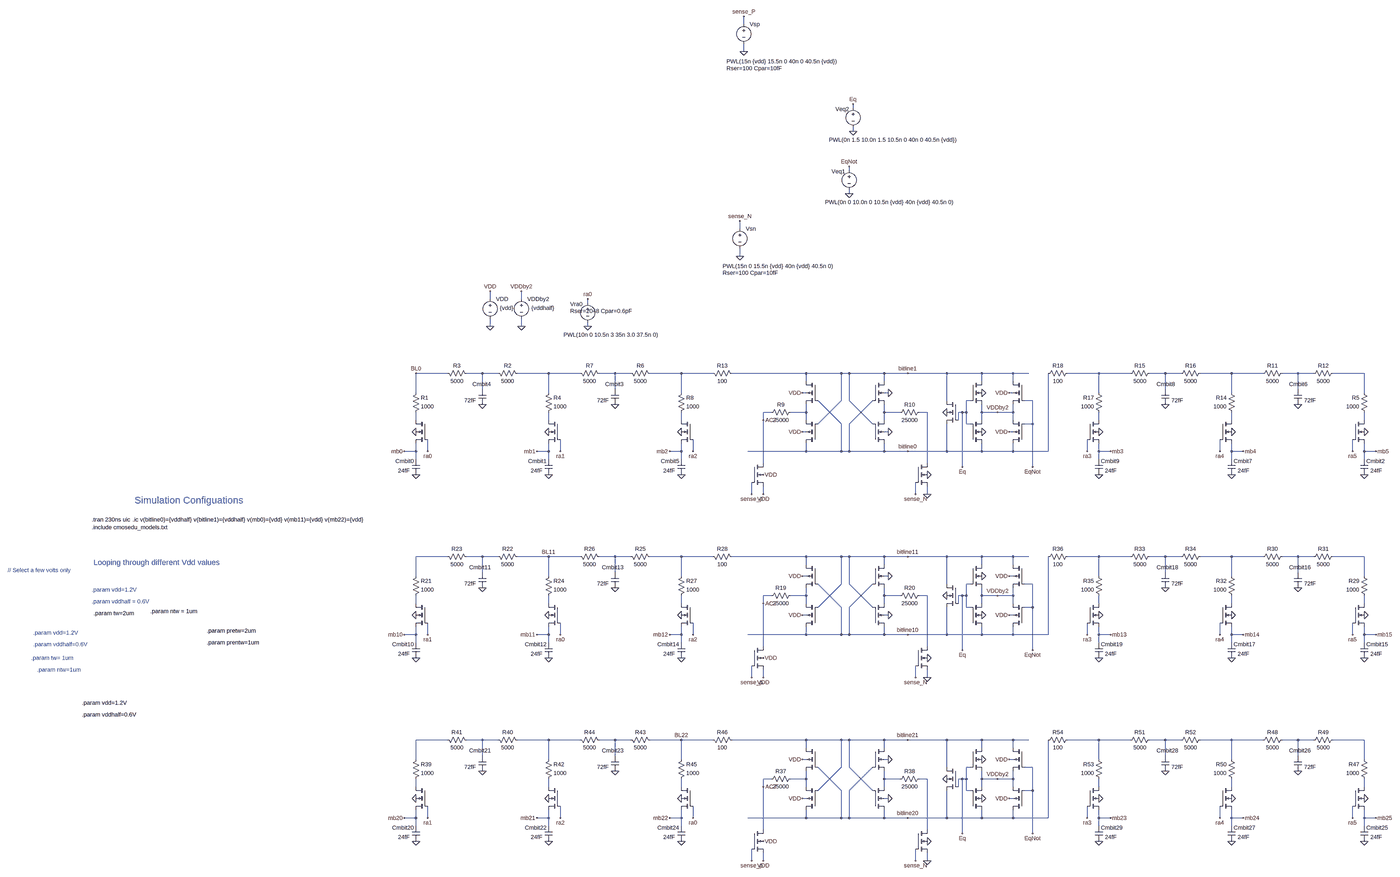
[diagram p0: schematic diva-dram_bitline.asc, whole sheet]
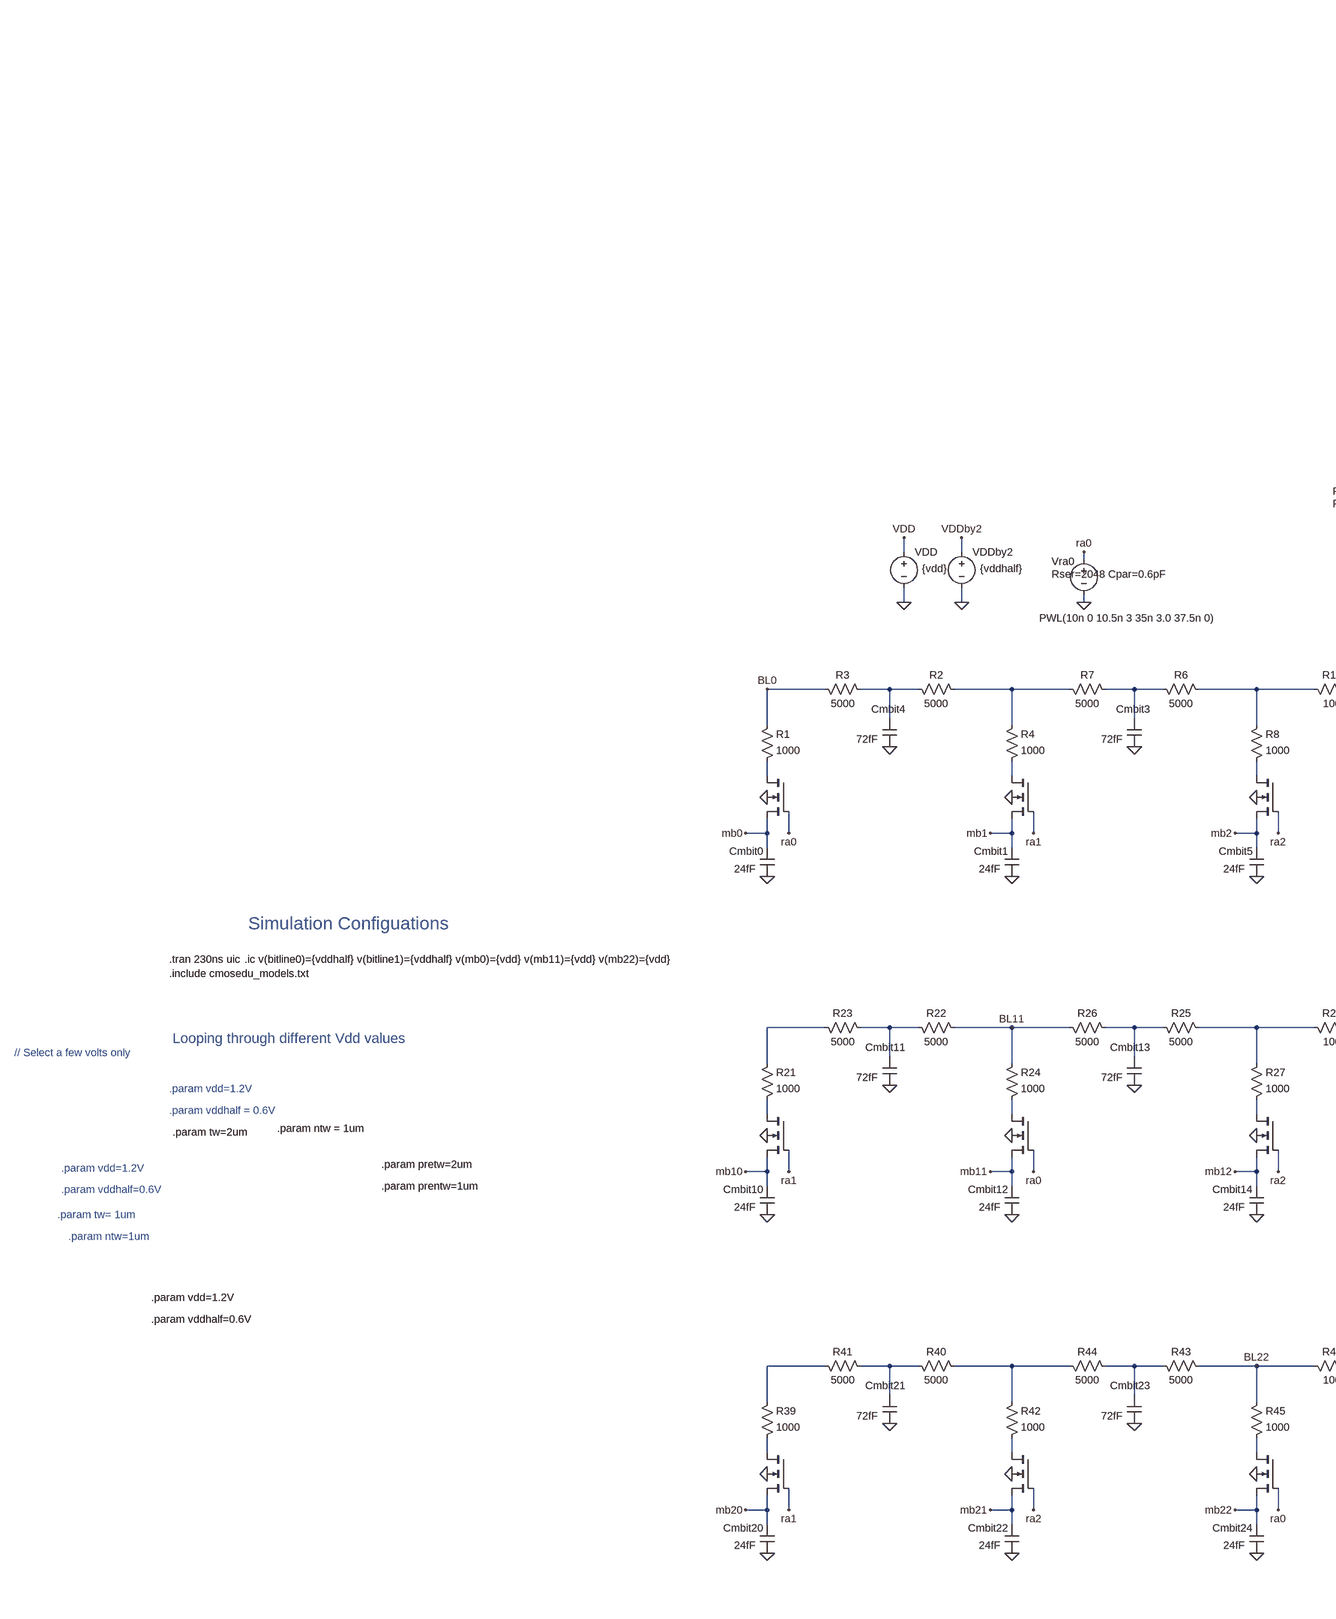
[diagram p1: schematic diva-dram_bitline.asc, part, row 1 of 1, column 1 of 2]
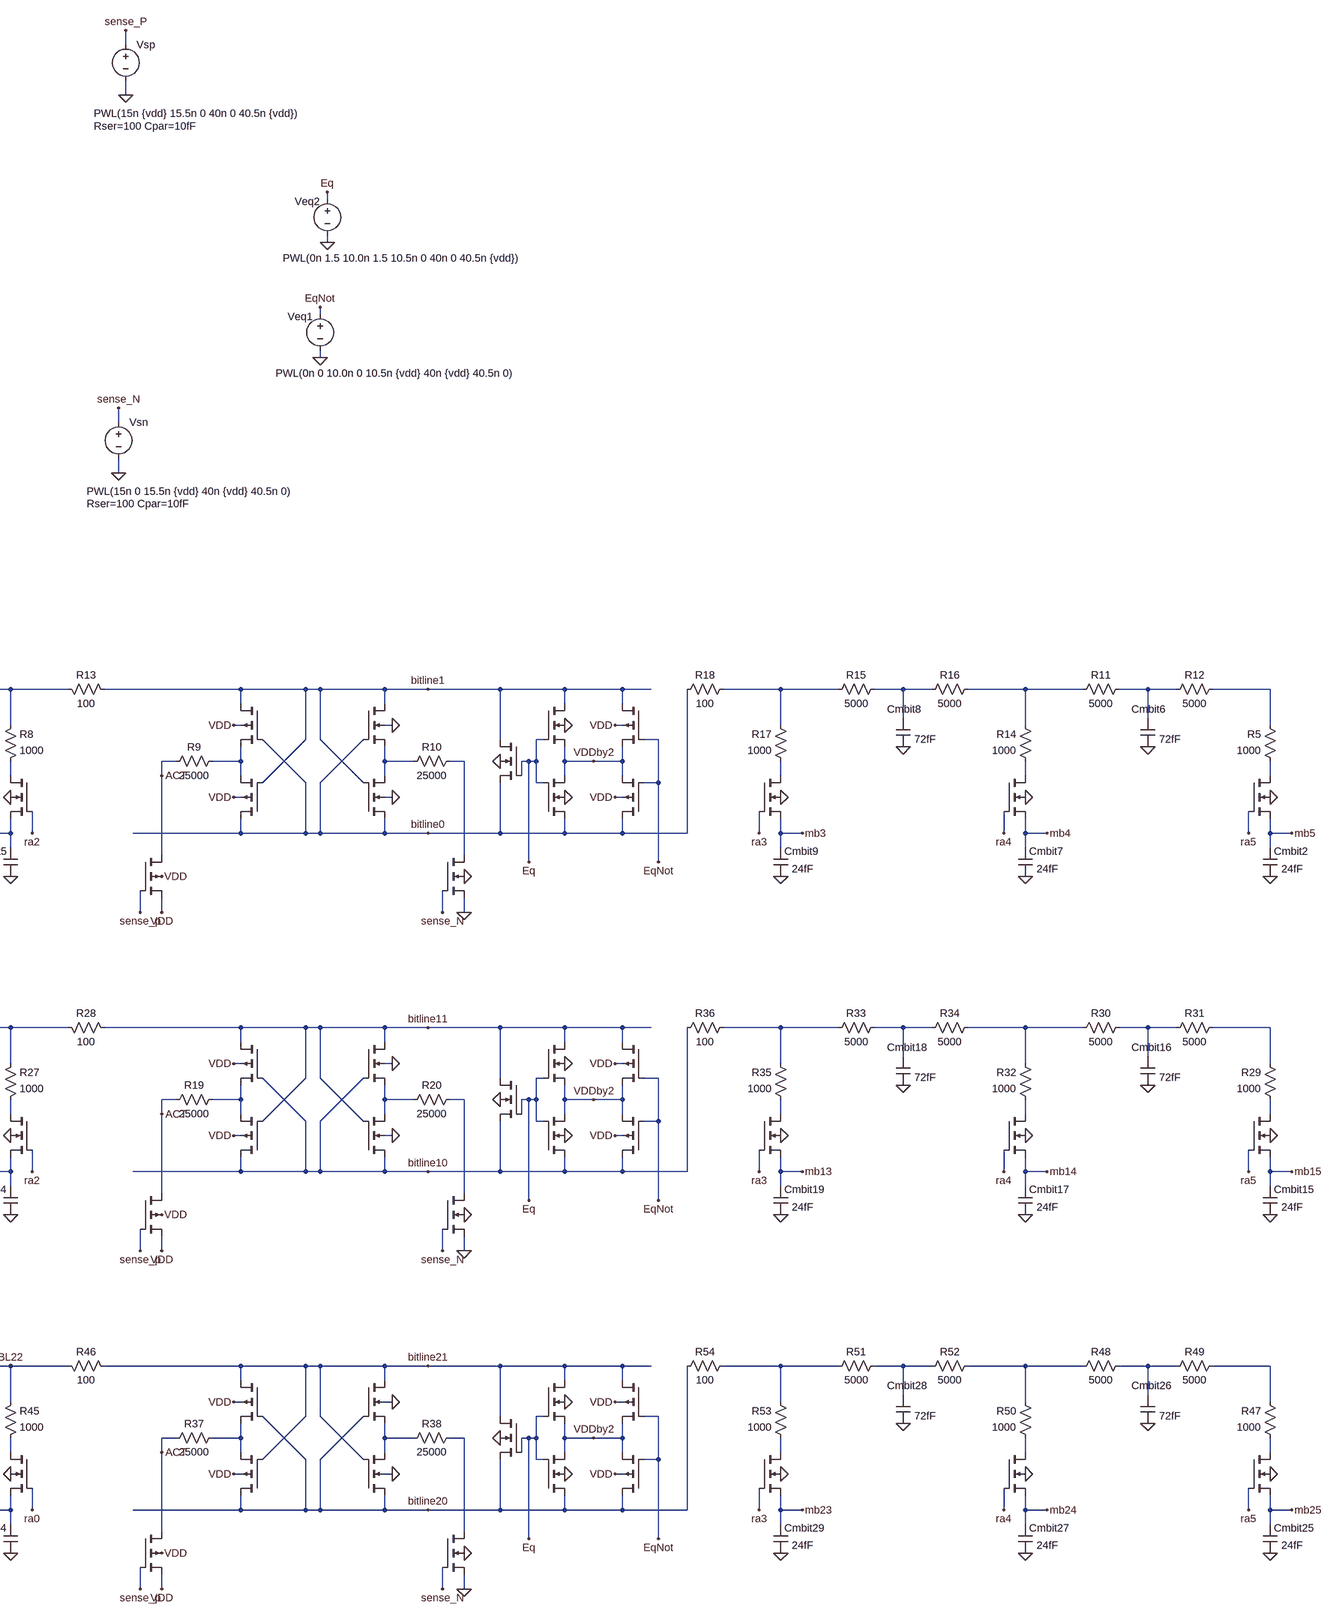
[diagram p2: schematic diva-dram_bitline.asc, part, row 1 of 1, column 2 of 2]
diva-dram_bitline.asc, the LTspice schematic file:
Version 4
SHEET 1 5584 2032
WIRE 2912 -2368 2912 -2400
WIRE 2912 -2256 2912 -2288
WIRE 3360 -2016 3360 -2032
WIRE 3360 -1920 3360 -1936
WIRE 3344 -1760 3344 -1776
WIRE 3344 -1664 3344 -1680
WIRE 2896 -1520 2896 -1552
WIRE 2896 -1408 2896 -1440
WIRE 1872 -1232 1872 -1264
WIRE 2000 -1232 2000 -1264
WIRE 2272 -1216 2272 -1232
WIRE 1872 -1120 1872 -1152
WIRE 2000 -1120 2000 -1152
WIRE 2272 -1120 2272 -1136
WIRE 1696 -112 1568 -112
WIRE 1840 -112 1776 -112
WIRE 1904 -112 1840 -112
WIRE 2112 -112 1984 -112
WIRE 2240 -112 2112 -112
WIRE 2384 -112 2320 -112
WIRE 2448 -112 2384 -112
WIRE 2656 -112 2528 -112
WIRE 2784 -112 2656 -112
WIRE 3168 -112 2864 -112
WIRE 3312 -112 3168 -112
WIRE 3344 -112 3312 -112
WIRE 3488 -112 3344 -112
WIRE 3584 -112 3488 -112
WIRE 3744 -112 3584 -112
WIRE 3888 -112 3744 -112
WIRE 4016 -112 3888 -112
WIRE 4080 -112 4016 -112
WIRE 4368 -112 4240 -112
WIRE 4496 -112 4368 -112
WIRE 4640 -112 4576 -112
WIRE 4704 -112 4640 -112
WIRE 4912 -112 4784 -112
WIRE 5040 -112 4912 -112
WIRE 5184 -112 5120 -112
WIRE 5248 -112 5184 -112
WIRE 5456 -112 5328 -112
WIRE 3168 -80 3168 -112
WIRE 3488 -80 3488 -112
WIRE 3888 -80 3888 -112
WIRE 4016 -80 4016 -112
WIRE 1840 -48 1840 -112
WIRE 2384 -48 2384 -112
WIRE 4640 -48 4640 -112
WIRE 5184 -48 5184 -112
WIRE 1568 -32 1568 -112
WIRE 2112 -32 2112 -112
WIRE 2656 -32 2656 -112
WIRE 3168 -32 3152 -32
WIRE 3504 -32 3488 -32
WIRE 4016 -32 4000 -32
WIRE 4368 -32 4368 -112
WIRE 4912 -32 4912 -112
WIRE 5456 -32 5456 -112
WIRE 3312 0 3312 -112
WIRE 3344 0 3344 -112
WIRE 3744 0 3744 -112
WIRE 3840 0 3824 0
WIRE 4096 0 4064 0
WIRE 3024 48 2992 48
WIRE 3168 48 3168 16
WIRE 3168 48 3104 48
WIRE 3488 48 3488 16
WIRE 3552 48 3488 48
WIRE 3664 48 3632 48
WIRE 3808 48 3792 48
WIRE 3824 48 3824 0
WIRE 3824 48 3808 48
WIRE 3888 48 3888 16
WIRE 3952 48 3888 48
WIRE 4016 48 4016 16
WIRE 4016 48 3952 48
WIRE 1568 80 1568 48
WIRE 2112 80 2112 48
WIRE 2656 80 2656 48
WIRE 2992 80 2992 48
WIRE 3168 80 3168 48
WIRE 3488 80 3488 48
WIRE 3792 80 3792 48
WIRE 3888 80 3888 48
WIRE 4016 80 4016 48
WIRE 4368 80 4368 48
WIRE 4912 80 4912 48
WIRE 5456 80 5456 48
WIRE 3216 96 3312 0
WIRE 3312 96 3216 0
WIRE 3344 96 3440 0
WIRE 3440 96 3344 0
WIRE 3824 96 3824 48
WIRE 3840 96 3824 96
WIRE 4096 96 4096 0
WIRE 4096 96 4064 96
WIRE 3168 128 3152 128
WIRE 3504 128 3488 128
WIRE 4016 128 4000 128
WIRE 1568 208 1568 176
WIRE 1568 208 1520 208
WIRE 1616 208 1616 160
WIRE 2112 208 2112 176
WIRE 2112 208 2064 208
WIRE 2160 208 2160 160
WIRE 2656 208 2656 176
WIRE 2656 208 2608 208
WIRE 2704 208 2704 160
WIRE 3168 208 3168 176
WIRE 3168 208 2928 208
WIRE 3312 208 3312 96
WIRE 3312 208 3168 208
WIRE 3344 208 3344 96
WIRE 3344 208 3312 208
WIRE 3488 208 3488 176
WIRE 3488 208 3344 208
WIRE 3584 208 3488 208
WIRE 3744 208 3744 96
WIRE 3744 208 3584 208
WIRE 3888 208 3888 176
WIRE 3888 208 3744 208
WIRE 4016 208 4016 176
WIRE 4016 208 3888 208
WIRE 4160 208 4160 -112
WIRE 4160 208 4016 208
WIRE 4320 208 4320 160
WIRE 4368 208 4368 176
WIRE 4416 208 4368 208
WIRE 4864 208 4864 160
WIRE 4912 208 4912 176
WIRE 4960 208 4912 208
WIRE 5408 208 5408 160
WIRE 5456 208 5456 176
WIRE 5504 208 5456 208
WIRE 1568 240 1568 208
WIRE 2112 240 2112 208
WIRE 2656 240 2656 208
WIRE 4368 240 4368 208
WIRE 4912 240 4912 208
WIRE 5456 240 5456 208
WIRE 2992 256 2992 80
WIRE 3664 256 3664 48
WIRE 3808 272 3808 48
WIRE 4096 272 4096 96
WIRE 2944 384 2944 336
WIRE 2992 384 2992 352
WIRE 3616 384 3616 336
WIRE 3664 384 3664 352
WIRE 1696 640 1568 640
WIRE 1840 640 1776 640
WIRE 1904 640 1840 640
WIRE 2112 640 1984 640
WIRE 2240 640 2112 640
WIRE 2384 640 2320 640
WIRE 2448 640 2384 640
WIRE 2656 640 2528 640
WIRE 2784 640 2656 640
WIRE 3168 640 2864 640
WIRE 3312 640 3168 640
WIRE 3344 640 3312 640
WIRE 3488 640 3344 640
WIRE 3584 640 3488 640
WIRE 3744 640 3584 640
WIRE 3888 640 3744 640
WIRE 4016 640 3888 640
WIRE 4080 640 4016 640
WIRE 4368 640 4240 640
WIRE 4496 640 4368 640
WIRE 4640 640 4576 640
WIRE 4704 640 4640 640
WIRE 4912 640 4784 640
WIRE 5040 640 4912 640
WIRE 5184 640 5120 640
WIRE 5248 640 5184 640
WIRE 5456 640 5328 640
WIRE 3168 672 3168 640
WIRE 3488 672 3488 640
WIRE 3888 672 3888 640
WIRE 4016 672 4016 640
WIRE 1840 704 1840 640
WIRE 2384 704 2384 640
WIRE 4640 704 4640 640
WIRE 5184 704 5184 640
WIRE 1568 720 1568 640
WIRE 2112 720 2112 640
WIRE 2656 720 2656 640
WIRE 3168 720 3152 720
WIRE 3504 720 3488 720
WIRE 4016 720 4000 720
WIRE 4368 720 4368 640
WIRE 4912 720 4912 640
WIRE 5456 720 5456 640
WIRE 3312 752 3312 640
WIRE 3344 752 3344 640
WIRE 3744 752 3744 640
WIRE 3840 752 3824 752
WIRE 4096 752 4064 752
WIRE 3024 800 2992 800
WIRE 3168 800 3168 768
WIRE 3168 800 3104 800
WIRE 3488 800 3488 768
WIRE 3552 800 3488 800
WIRE 3664 800 3632 800
WIRE 3808 800 3792 800
WIRE 3824 800 3824 752
WIRE 3824 800 3808 800
WIRE 3888 800 3888 768
WIRE 3952 800 3888 800
WIRE 4016 800 4016 768
WIRE 4016 800 3952 800
WIRE 1568 832 1568 800
WIRE 2112 832 2112 800
WIRE 2656 832 2656 800
WIRE 2992 832 2992 800
WIRE 3168 832 3168 800
WIRE 3488 832 3488 800
WIRE 3792 832 3792 800
WIRE 3888 832 3888 800
WIRE 4016 832 4016 800
WIRE 4368 832 4368 800
WIRE 4912 832 4912 800
WIRE 5456 832 5456 800
WIRE 3216 848 3312 752
WIRE 3312 848 3216 752
WIRE 3344 848 3440 752
WIRE 3440 848 3344 752
WIRE 3824 848 3824 800
WIRE 3840 848 3824 848
WIRE 4096 848 4096 752
WIRE 4096 848 4064 848
WIRE 3168 880 3152 880
WIRE 3504 880 3488 880
WIRE 4016 880 4000 880
WIRE 1568 960 1568 928
WIRE 1568 960 1520 960
WIRE 1616 960 1616 912
WIRE 2112 960 2112 928
WIRE 2112 960 2064 960
WIRE 2160 960 2160 912
WIRE 2656 960 2656 928
WIRE 2656 960 2608 960
WIRE 2704 960 2704 912
WIRE 3168 960 3168 928
WIRE 3168 960 2928 960
WIRE 3312 960 3312 848
WIRE 3312 960 3168 960
WIRE 3344 960 3344 848
WIRE 3344 960 3312 960
WIRE 3488 960 3488 928
WIRE 3488 960 3344 960
WIRE 3584 960 3488 960
WIRE 3744 960 3744 848
WIRE 3744 960 3584 960
WIRE 3888 960 3888 928
WIRE 3888 960 3744 960
WIRE 4016 960 4016 928
WIRE 4016 960 3888 960
WIRE 4160 960 4160 640
WIRE 4160 960 4016 960
WIRE 4320 960 4320 912
WIRE 4368 960 4368 928
WIRE 4416 960 4368 960
WIRE 4864 960 4864 912
WIRE 4912 960 4912 928
WIRE 4960 960 4912 960
WIRE 5408 960 5408 912
WIRE 5456 960 5456 928
WIRE 5504 960 5456 960
WIRE 1568 992 1568 960
WIRE 2112 992 2112 960
WIRE 2656 992 2656 960
WIRE 4368 992 4368 960
WIRE 4912 992 4912 960
WIRE 5456 992 5456 960
WIRE 2992 1008 2992 832
WIRE 3664 1008 3664 800
WIRE 3808 1024 3808 800
WIRE 4096 1024 4096 848
WIRE 2944 1136 2944 1088
WIRE 2992 1136 2992 1104
WIRE 3616 1136 3616 1088
WIRE 3664 1136 3664 1104
WIRE 1696 1392 1568 1392
WIRE 1840 1392 1776 1392
WIRE 1904 1392 1840 1392
WIRE 2112 1392 1984 1392
WIRE 2240 1392 2112 1392
WIRE 2384 1392 2320 1392
WIRE 2448 1392 2384 1392
WIRE 2656 1392 2528 1392
WIRE 2784 1392 2656 1392
WIRE 3168 1392 2864 1392
WIRE 3312 1392 3168 1392
WIRE 3344 1392 3312 1392
WIRE 3488 1392 3344 1392
WIRE 3584 1392 3488 1392
WIRE 3744 1392 3584 1392
WIRE 3888 1392 3744 1392
WIRE 4016 1392 3888 1392
WIRE 4080 1392 4016 1392
WIRE 4368 1392 4240 1392
WIRE 4496 1392 4368 1392
WIRE 4640 1392 4576 1392
WIRE 4704 1392 4640 1392
WIRE 4912 1392 4784 1392
WIRE 5040 1392 4912 1392
WIRE 5184 1392 5120 1392
WIRE 5248 1392 5184 1392
WIRE 5456 1392 5328 1392
WIRE 3168 1424 3168 1392
WIRE 3488 1424 3488 1392
WIRE 3888 1424 3888 1392
WIRE 4016 1424 4016 1392
WIRE 1840 1456 1840 1392
WIRE 2384 1456 2384 1392
WIRE 4640 1456 4640 1392
WIRE 5184 1456 5184 1392
WIRE 1568 1472 1568 1392
WIRE 2112 1472 2112 1392
WIRE 2656 1472 2656 1392
WIRE 3168 1472 3152 1472
WIRE 3504 1472 3488 1472
WIRE 4016 1472 4000 1472
WIRE 4368 1472 4368 1392
WIRE 4912 1472 4912 1392
WIRE 5456 1472 5456 1392
WIRE 3312 1504 3312 1392
WIRE 3344 1504 3344 1392
WIRE 3744 1504 3744 1392
WIRE 3840 1504 3824 1504
WIRE 4096 1504 4064 1504
WIRE 3024 1552 2992 1552
WIRE 3168 1552 3168 1520
WIRE 3168 1552 3104 1552
WIRE 3488 1552 3488 1520
WIRE 3552 1552 3488 1552
WIRE 3664 1552 3632 1552
WIRE 3808 1552 3792 1552
WIRE 3824 1552 3824 1504
WIRE 3824 1552 3808 1552
WIRE 3888 1552 3888 1520
WIRE 3952 1552 3888 1552
WIRE 4016 1552 4016 1520
WIRE 4016 1552 3952 1552
WIRE 1568 1584 1568 1552
WIRE 2112 1584 2112 1552
WIRE 2656 1584 2656 1552
WIRE 2992 1584 2992 1552
WIRE 3168 1584 3168 1552
WIRE 3488 1584 3488 1552
WIRE 3792 1584 3792 1552
WIRE 3888 1584 3888 1552
WIRE 4016 1584 4016 1552
WIRE 4368 1584 4368 1552
WIRE 4912 1584 4912 1552
WIRE 5456 1584 5456 1552
WIRE 3216 1600 3312 1504
WIRE 3312 1600 3216 1504
WIRE 3344 1600 3440 1504
WIRE 3440 1600 3344 1504
WIRE 3824 1600 3824 1552
WIRE 3840 1600 3824 1600
WIRE 4096 1600 4096 1504
WIRE 4096 1600 4064 1600
WIRE 3168 1632 3152 1632
WIRE 3504 1632 3488 1632
WIRE 4016 1632 4000 1632
WIRE 1568 1712 1568 1680
WIRE 1568 1712 1520 1712
WIRE 1616 1712 1616 1664
WIRE 2112 1712 2112 1680
WIRE 2112 1712 2064 1712
WIRE 2160 1712 2160 1664
WIRE 2656 1712 2656 1680
WIRE 2656 1712 2608 1712
WIRE 2704 1712 2704 1664
WIRE 3168 1712 3168 1680
WIRE 3168 1712 2928 1712
WIRE 3312 1712 3312 1600
WIRE 3312 1712 3168 1712
WIRE 3344 1712 3344 1600
WIRE 3344 1712 3312 1712
WIRE 3488 1712 3488 1680
WIRE 3488 1712 3344 1712
WIRE 3584 1712 3488 1712
WIRE 3744 1712 3744 1600
WIRE 3744 1712 3584 1712
WIRE 3888 1712 3888 1680
WIRE 3888 1712 3744 1712
WIRE 4016 1712 4016 1680
WIRE 4016 1712 3888 1712
WIRE 4160 1712 4160 1392
WIRE 4160 1712 4016 1712
WIRE 4320 1712 4320 1664
WIRE 4368 1712 4368 1680
WIRE 4416 1712 4368 1712
WIRE 4864 1712 4864 1664
WIRE 4912 1712 4912 1680
WIRE 4960 1712 4912 1712
WIRE 5408 1712 5408 1664
WIRE 5456 1712 5456 1680
WIRE 5504 1712 5456 1712
WIRE 1568 1744 1568 1712
WIRE 2112 1744 2112 1712
WIRE 2656 1744 2656 1712
WIRE 4368 1744 4368 1712
WIRE 4912 1744 4912 1712
WIRE 5456 1744 5456 1712
WIRE 2992 1760 2992 1584
WIRE 3664 1760 3664 1552
WIRE 3808 1776 3808 1552
WIRE 4096 1776 4096 1600
WIRE 2944 1888 2944 1840
WIRE 2992 1888 2992 1856
WIRE 3616 1888 3616 1840
WIRE 3664 1888 3664 1856
FLAG 1872 -1120 0
FLAG 1872 -1264 VDD
FLAG 2000 -1120 0
FLAG 2000 -1264 VDDby2
FLAG 2912 -2256 0
FLAG 2912 -2400 sense_P
FLAG 2272 -1120 0
FLAG 2272 -1232 ra0
FLAG 2896 -1408 0
FLAG 2896 -1552 sense_N
FLAG 3344 -1664 0
FLAG 3344 -1776 EqNot
FLAG 3360 -1920 0
FLAG 3360 -2032 Eq
FLAG 3152 -32 VDD
FLAG 2992 80 ACT
FLAG 3152 128 VDD
FLAG 3504 128 0
FLAG 3504 -32 0
FLAG 3744 48 0
FLAG 3888 128 0
FLAG 3888 -32 0
FLAG 3808 272 Eq
FLAG 3952 48 VDDby2
FLAG 3584 208 bitline0
FLAG 3584 -112 bitline1
FLAG 4096 272 EqNot
FLAG 4000 128 VDD
FLAG 4000 -32 VDD
FLAG 3664 304 0
FLAG 3616 384 sense_N
FLAG 3664 384 0
FLAG 2992 304 VDD
FLAG 2992 384 VDD
FLAG 2944 384 sense_p
FLAG 1568 128 0
FLAG 1568 304 0
FLAG 1520 208 mb0
FLAG 1616 208 ra0
FLAG 1840 16 0
FLAG 2112 128 0
FLAG 2112 304 0
FLAG 2064 208 mb1
FLAG 2160 208 ra1
FLAG 2384 16 0
FLAG 2656 128 0
FLAG 2656 304 0
FLAG 2608 208 mb2
FLAG 2704 208 ra2
FLAG 5456 128 0
FLAG 5456 304 0
FLAG 5504 208 mb5
FLAG 5408 208 ra5
FLAG 5184 16 0
FLAG 4912 128 0
FLAG 4912 304 0
FLAG 4960 208 mb4
FLAG 4864 208 ra4
FLAG 4640 16 0
FLAG 4368 128 0
FLAG 4368 304 0
FLAG 4416 208 mb3
FLAG 4320 208 ra3
FLAG 3152 720 VDD
FLAG 2992 832 ACT
FLAG 3152 880 VDD
FLAG 3504 880 0
FLAG 3504 720 0
FLAG 3744 800 0
FLAG 3888 880 0
FLAG 3888 720 0
FLAG 3808 1024 Eq
FLAG 3952 800 VDDby2
FLAG 3584 960 bitline10
FLAG 3584 640 bitline11
FLAG 4096 1024 EqNot
FLAG 4000 880 VDD
FLAG 4000 720 VDD
FLAG 3664 1056 0
FLAG 3616 1136 sense_N
FLAG 3664 1136 0
FLAG 2992 1056 VDD
FLAG 2992 1136 VDD
FLAG 2944 1136 sense_p
FLAG 1568 880 0
FLAG 1568 1056 0
FLAG 1520 960 mb10
FLAG 1616 960 ra1
FLAG 1840 768 0
FLAG 2112 880 0
FLAG 2112 1056 0
FLAG 2064 960 mb11
FLAG 2160 960 ra0
FLAG 2384 768 0
FLAG 2656 880 0
FLAG 2656 1056 0
FLAG 2608 960 mb12
FLAG 2704 960 ra2
FLAG 5456 880 0
FLAG 5456 1056 0
FLAG 5504 960 mb15
FLAG 5408 960 ra5
FLAG 5184 768 0
FLAG 4912 880 0
FLAG 4912 1056 0
FLAG 4960 960 mb14
FLAG 4864 960 ra4
FLAG 4640 768 0
FLAG 4368 880 0
FLAG 4368 1056 0
FLAG 4416 960 mb13
FLAG 4320 960 ra3
FLAG 1568 -112 BL0
FLAG 2112 640 BL11
FLAG 3152 1472 VDD
FLAG 2992 1584 ACT
FLAG 3152 1632 VDD
FLAG 3504 1632 0
FLAG 3504 1472 0
FLAG 3744 1552 0
FLAG 3888 1632 0
FLAG 3888 1472 0
FLAG 3808 1776 Eq
FLAG 3952 1552 VDDby2
FLAG 3584 1712 bitline20
FLAG 3584 1392 bitline21
FLAG 4096 1776 EqNot
FLAG 4000 1632 VDD
FLAG 4000 1472 VDD
FLAG 3664 1808 0
FLAG 3616 1888 sense_N
FLAG 3664 1888 0
FLAG 2992 1808 VDD
FLAG 2992 1888 VDD
FLAG 2944 1888 sense_p
FLAG 1568 1632 0
FLAG 1568 1808 0
FLAG 1520 1712 mb20
FLAG 1616 1712 ra1
FLAG 1840 1520 0
FLAG 2112 1632 0
FLAG 2112 1808 0
FLAG 2064 1712 mb21
FLAG 2160 1712 ra2
FLAG 2384 1520 0
FLAG 2656 1632 0
FLAG 2656 1808 0
FLAG 2608 1712 mb22
FLAG 2704 1712 ra0
FLAG 5456 1632 0
FLAG 5456 1808 0
FLAG 5504 1712 mb25
FLAG 5408 1712 ra5
FLAG 5184 1520 0
FLAG 4912 1632 0
FLAG 4912 1808 0
FLAG 4960 1712 mb24
FLAG 4864 1712 ra4
FLAG 4640 1520 0
FLAG 4368 1632 0
FLAG 4368 1808 0
FLAG 4416 1712 mb23
FLAG 4320 1712 ra3
FLAG 2656 1392 BL22
SYMBOL voltage 1872 -1248 R0
WINDOW 123 0 0 Left 2
WINDOW 39 0 0 Left 2
WINDOW 3 40 53 Left 2
SYMATTR Value {vdd}
SYMATTR InstName VDD
SYMBOL voltage 2000 -1248 R0
WINDOW 123 0 0 Left 2
WINDOW 39 0 0 Left 2
WINDOW 3 41 53 Left 2
SYMATTR Value {vddhalf}
SYMATTR InstName VDDby2
SYMBOL voltage 2912 -2384 R0
WINDOW 123 0 0 Left 2
WINDOW 39 -71 197 Left 2
WINDOW 3 -71 169 Left 2
SYMATTR SpiceLine Rser=100 Cpar=10fF
SYMATTR Value PWL(15n {vdd} 15.5n 0 40n 0 40.5n {vdd})
SYMATTR InstName Vsp
SYMBOL voltage 2272 -1232 R0
WINDOW 0 -72 21 Left 2
WINDOW 3 -99 147 Left 2
WINDOW 123 0 0 Left 2
WINDOW 39 -72 49 Left 2
SYMATTR InstName Vra0
SYMATTR Value PWL(10n 0 10.5n 3 35n 3.0 37.5n 0)
SYMATTR SpiceLine Rser=2048 Cpar=0.6pF
SYMBOL voltage 2896 -1536 R0
WINDOW 123 0 0 Left 2
WINDOW 39 -71 197 Left 2
WINDOW 3 -71 169 Left 2
SYMATTR SpiceLine Rser=100 Cpar=10fF
SYMATTR Value PWL(15n 0 15.5n {vdd} 40n {vdd} 40.5n 0)
SYMATTR InstName Vsn
SYMBOL voltage 3344 -1776 R0
WINDOW 0 -72 21 Left 2
WINDOW 3 -99 147 Left 2
WINDOW 123 0 0 Left 2
WINDOW 39 0 0 Left 2
SYMATTR InstName Veq1
SYMATTR Value PWL(0n 0 10.0n 0 10.5n {vdd} 40n {vdd} 40.5n 0)
SYMBOL voltage 3360 -2032 R0
WINDOW 0 -72 21 Left 2
WINDOW 3 -99 147 Left 2
WINDOW 123 0 0 Left 2
WINDOW 39 0 0 Left 2
SYMATTR InstName Veq2
SYMATTR Value PWL(0n 1.5 10.0n 1.5 10.5n 0 40n 0 40.5n {vdd})
SYMBOL pmos4 3216 -80 M0
WINDOW 0 56 32 Invisible 2
WINDOW 3 56 72 Invisible 2
SYMATTR InstName M15
SYMATTR Value pmos45hp
SYMATTR Value2 l=0.16um w={tw}
SYMBOL res 3120 32 R90
WINDOW 0 0 56 VBottom 2
WINDOW 3 32 56 VTop 2
SYMATTR InstName R9
SYMATTR Value 25000
SYMBOL pmos4 3216 176 R180
WINDOW 0 56 32 Invisible 2
WINDOW 3 56 72 Invisible 2
SYMATTR InstName M16
SYMATTR Value pmos45hp
SYMATTR Value2 l=0.16um w={tw}
SYMBOL nmos4 3440 -80 R0
WINDOW 0 104 24 Invisible 2
WINDOW 3 179 41 Invisible 2
SYMATTR InstName M17
SYMATTR Value nmos45hp
SYMATTR Value2 l=0.16um w={ntw}
SYMBOL nmos4 3440 176 M180
WINDOW 0 104 24 Invisible 2
WINDOW 3 179 41 Invisible 2
SYMATTR InstName M18
SYMATTR Value nmos45hp
SYMATTR Value2 l=0.16um w={ntw}
SYMBOL res 3648 32 R90
WINDOW 0 0 56 VBottom 2
WINDOW 3 32 56 VTop 2
SYMATTR InstName R10
SYMATTR Value 25000
SYMBOL nmos4 3792 0 M0
WINDOW 0 104 24 Invisible 2
WINDOW 3 179 41 Invisible 2
SYMATTR InstName M19
SYMATTR Value nmos45hp
SYMATTR Value2 l=0.5um w={prentw}
SYMBOL nmos4 3840 176 M180
WINDOW 0 104 24 Invisible 2
WINDOW 3 179 41 Invisible 2
SYMATTR InstName M20
SYMATTR Value nmos45hp
SYMATTR Value2 l=0.5um w={prentw}
SYMBOL nmos4 3840 -80 R0
WINDOW 0 104 24 Invisible 2
WINDOW 3 179 41 Invisible 2
SYMATTR InstName M21
SYMATTR Value nmos45hp
SYMATTR Value2 l=0.5um w={prentw}
SYMBOL pmos4 4064 176 R180
WINDOW 0 56 32 Invisible 2
WINDOW 3 56 72 Invisible 2
SYMATTR InstName M22
SYMATTR Value pmos45hp
SYMATTR Value2 l=0.5um w={pretw}
SYMBOL pmos4 4064 -80 M0
WINDOW 0 56 32 Invisible 2
WINDOW 3 56 72 Invisible 2
SYMATTR InstName M23
SYMATTR Value pmos45hp
SYMATTR Value2 l=0.5um w={pretw}
SYMBOL nmos4 3616 256 R0
WINDOW 0 104 24 Invisible 2
WINDOW 3 179 41 Invisible 2
SYMATTR InstName M24
SYMATTR Value nmos45lp
SYMATTR Value2 l=0.27um w=0.22um
SYMBOL pmos4 2944 256 R0
WINDOW 0 56 32 Invisible 2
WINDOW 3 56 72 Invisible 2
SYMATTR InstName M25
SYMATTR Value pmos45lp
SYMATTR Value2 l=0.27um w=0.22um
SYMBOL nmos4 1616 80 M0
WINDOW 0 104 24 Invisible 2
WINDOW 3 179 41 Invisible 2
SYMATTR InstName M1
SYMATTR Value nmos45lp
SYMATTR Value2 l=0.085um w=0.055um
SYMBOL cap 1584 240 M0
WINDOW 3 41 47 Left 2
SYMATTR Value 24fF
SYMATTR InstName Cmbit0
SYMBOL res 1552 64 M180
WINDOW 0 36 76 Left 2
WINDOW 3 36 40 Left 2
SYMATTR InstName R1
SYMATTR Value 1000
SYMBOL res 1888 -128 M90
WINDOW 3 32 56 VTop 2
WINDOW 0 0 56 VBottom 2
SYMATTR Value 5000
SYMATTR InstName R2
SYMBOL res 1680 -128 M90
WINDOW 3 32 56 VTop 2
WINDOW 0 0 56 VBottom 2
SYMATTR Value 5000
SYMATTR InstName R3
SYMBOL cap 1856 -48 M0
WINDOW 3 41 47 Left 2
WINDOW 0 -20 -20 Left 2
SYMATTR Value 72fF
SYMATTR InstName Cmbit4
SYMBOL nmos4 2160 80 M0
WINDOW 0 104 24 Invisible 2
WINDOW 3 179 41 Invisible 2
SYMATTR InstName M2
SYMATTR Value nmos45lp
SYMATTR Value2 l=0.085um w=0.055um
SYMBOL cap 2128 240 M0
WINDOW 3 41 47 Left 2
SYMATTR Value 24fF
SYMATTR InstName Cmbit1
SYMBOL res 2096 64 M180
WINDOW 0 36 76 Left 2
WINDOW 3 36 40 Left 2
SYMATTR InstName R4
SYMATTR Value 1000
SYMBOL res 2432 -128 M90
WINDOW 3 32 56 VTop 2
WINDOW 0 0 56 VBottom 2
SYMATTR Value 5000
SYMATTR InstName R6
SYMBOL res 2224 -128 M90
WINDOW 3 32 56 VTop 2
WINDOW 0 0 56 VBottom 2
SYMATTR Value 5000
SYMATTR InstName R7
SYMBOL cap 2400 -48 M0
WINDOW 3 41 47 Left 2
WINDOW 0 -20 -20 Left 2
SYMATTR Value 72fF
SYMATTR InstName Cmbit3
SYMBOL nmos4 2704 80 M0
WINDOW 0 104 24 Invisible 2
WINDOW 3 179 41 Invisible 2
SYMATTR InstName M3
SYMATTR Value nmos45lp
SYMATTR Value2 l=0.085um w=0.055um
SYMBOL cap 2672 240 M0
WINDOW 3 41 47 Left 2
SYMATTR Value 24fF
SYMATTR InstName Cmbit5
SYMBOL res 2640 64 M180
WINDOW 0 36 76 Left 2
WINDOW 3 36 40 Left 2
SYMATTR InstName R8
SYMATTR Value 1000
SYMBOL res 2768 -128 M90
WINDOW 3 32 56 VTop 2
WINDOW 0 0 56 VBottom 2
SYMATTR Value 100
SYMATTR InstName R13
SYMBOL nmos4 5408 80 R0
WINDOW 0 104 24 Invisible 2
WINDOW 3 179 41 Invisible 2
SYMATTR InstName M4
SYMATTR Value nmos45lp
SYMATTR Value2 l=0.085um w=0.055um
SYMBOL cap 5440 240 R0
WINDOW 3 41 47 Left 2
SYMATTR Value 24fF
SYMATTR InstName Cmbit2
SYMBOL res 5472 64 R180
WINDOW 0 36 76 Left 2
WINDOW 3 36 40 Left 2
SYMATTR InstName R5
SYMATTR Value 1000
SYMBOL res 5136 -128 R90
WINDOW 3 32 56 VTop 2
WINDOW 0 0 56 VBottom 2
SYMATTR Value 5000
SYMATTR InstName R11
SYMBOL res 5344 -128 R90
WINDOW 3 32 56 VTop 2
WINDOW 0 0 56 VBottom 2
SYMATTR Value 5000
SYMATTR InstName R12
SYMBOL cap 5168 -48 R0
WINDOW 3 41 47 Left 2
WINDOW 0 -20 -20 Left 2
SYMATTR Value 72fF
SYMATTR InstName Cmbit6
SYMBOL nmos4 4864 80 R0
WINDOW 0 104 24 Invisible 2
WINDOW 3 179 41 Invisible 2
SYMATTR InstName M5
SYMATTR Value nmos45lp
SYMATTR Value2 l=0.085um w=0.055um
SYMBOL cap 4896 240 R0
WINDOW 3 41 47 Left 2
SYMATTR Value 24fF
SYMATTR InstName Cmbit7
SYMBOL res 4928 64 R180
WINDOW 0 36 76 Left 2
WINDOW 3 36 40 Left 2
SYMATTR InstName R14
SYMATTR Value 1000
SYMBOL res 4592 -128 R90
WINDOW 3 32 56 VTop 2
WINDOW 0 0 56 VBottom 2
SYMATTR Value 5000
SYMATTR InstName R15
SYMBOL res 4800 -128 R90
WINDOW 3 32 56 VTop 2
WINDOW 0 0 56 VBottom 2
SYMATTR Value 5000
SYMATTR InstName R16
SYMBOL cap 4624 -48 R0
WINDOW 3 41 47 Left 2
WINDOW 0 -20 -20 Left 2
SYMATTR Value 72fF
SYMATTR InstName Cmbit8
SYMBOL nmos4 4320 80 R0
WINDOW 0 104 24 Invisible 2
WINDOW 3 179 41 Invisible 2
SYMATTR InstName M6
SYMATTR Value nmos45lp
SYMATTR Value2 l=0.085um w=0.055um
SYMBOL cap 4352 240 R0
WINDOW 3 41 47 Left 2
SYMATTR Value 24fF
SYMATTR InstName Cmbit9
SYMBOL res 4384 64 R180
WINDOW 0 36 76 Left 2
WINDOW 3 36 40 Left 2
SYMATTR InstName R17
SYMATTR Value 1000
SYMBOL res 4256 -128 R90
WINDOW 3 32 56 VTop 2
WINDOW 0 0 56 VBottom 2
SYMATTR Value 100
SYMATTR InstName R18
SYMBOL pmos4 3216 672 M0
WINDOW 0 56 32 Invisible 2
WINDOW 3 56 72 Invisible 2
SYMATTR InstName M7
SYMATTR Value pmos45hp
SYMATTR Value2 l=0.16um w={tw}
SYMBOL res 3120 784 R90
WINDOW 0 0 56 VBottom 2
WINDOW 3 32 56 VTop 2
SYMATTR InstName R19
SYMATTR Value 25000
SYMBOL pmos4 3216 928 R180
WINDOW 0 56 32 Invisible 2
WINDOW 3 56 72 Invisible 2
SYMATTR InstName M8
SYMATTR Value pmos45hp
SYMATTR Value2 l=0.16um w={tw}
SYMBOL nmos4 3440 672 R0
WINDOW 0 104 24 Invisible 2
WINDOW 3 179 41 Invisible 2
SYMATTR InstName M9
SYMATTR Value nmos45hp
SYMATTR Value2 l=0.16um w={ntw}
SYMBOL nmos4 3440 928 M180
WINDOW 0 104 24 Invisible 2
WINDOW 3 179 41 Invisible 2
SYMATTR InstName M10
SYMATTR Value nmos45hp
SYMATTR Value2 l=0.16um w={ntw}
SYMBOL res 3648 784 R90
WINDOW 0 0 56 VBottom 2
WINDOW 3 32 56 VTop 2
SYMATTR InstName R20
SYMATTR Value 25000
SYMBOL nmos4 3792 752 M0
WINDOW 0 104 24 Invisible 2
WINDOW 3 179 41 Invisible 2
SYMATTR InstName M11
SYMATTR Value nmos45hp
SYMATTR Value2 l=0.5um w={prentw}
SYMBOL nmos4 3840 928 M180
WINDOW 0 104 24 Invisible 2
WINDOW 3 179 41 Invisible 2
SYMATTR InstName M12
SYMATTR Value nmos45hp
SYMATTR Value2 l=0.5um w={prentw}
SYMBOL nmos4 3840 672 R0
WINDOW 0 104 24 Invisible 2
WINDOW 3 179 41 Invisible 2
SYMATTR InstName M13
SYMATTR Value nmos45hp
SYMATTR Value2 l=0.5um w={prentw}
SYMBOL pmos4 4064 928 R180
WINDOW 0 56 32 Invisible 2
WINDOW 3 56 72 Invisible 2
SYMATTR InstName M14
SYMATTR Value pmos45hp
SYMATTR Value2 l=0.5um w={pretw}
SYMBOL pmos4 4064 672 M0
WINDOW 0 56 32 Invisible 2
WINDOW 3 56 72 Invisible 2
SYMATTR InstName M26
SYMATTR Value pmos45hp
SYMATTR Value2 l=0.5um w={pretw}
SYMBOL nmos4 3616 1008 R0
WINDOW 0 104 24 Invisible 2
WINDOW 3 179 41 Invisible 2
SYMATTR InstName M27
SYMATTR Value nmos45lp
SYMATTR Value2 l=0.27um w=0.22um
SYMBOL pmos4 2944 1008 R0
WINDOW 0 56 32 Invisible 2
WINDOW 3 56 72 Invisible 2
SYMATTR InstName M28
SYMATTR Value pmos45lp
SYMATTR Value2 l=0.27um w=0.22um
SYMBOL nmos4 1616 832 M0
WINDOW 0 104 24 Invisible 2
WINDOW 3 179 41 Invisible 2
SYMATTR InstName M29
SYMATTR Value nmos45lp
SYMATTR Value2 l=0.085um w=0.055um
SYMBOL cap 1584 992 M0
WINDOW 3 41 47 Left 2
SYMATTR Value 24fF
SYMATTR InstName Cmbit10
SYMBOL res 1552 816 M180
WINDOW 0 36 76 Left 2
WINDOW 3 36 40 Left 2
SYMATTR InstName R21
SYMATTR Value 1000
SYMBOL res 1888 624 M90
WINDOW 3 32 56 VTop 2
WINDOW 0 0 56 VBottom 2
SYMATTR Value 5000
SYMATTR InstName R22
SYMBOL res 1680 624 M90
WINDOW 3 32 56 VTop 2
WINDOW 0 0 56 VBottom 2
SYMATTR Value 5000
SYMATTR InstName R23
SYMBOL cap 1856 704 M0
WINDOW 3 41 47 Left 2
WINDOW 0 -20 -20 Left 2
SYMATTR Value 72fF
SYMATTR InstName Cmbit11
SYMBOL nmos4 2160 832 M0
WINDOW 0 104 24 Invisible 2
WINDOW 3 179 41 Invisible 2
SYMATTR InstName M30
SYMATTR Value nmos45lp
SYMATTR Value2 l=0.085um w=0.055um
SYMBOL cap 2128 992 M0
WINDOW 3 41 47 Left 2
SYMATTR Value 24fF
SYMATTR InstName Cmbit12
SYMBOL res 2096 816 M180
WINDOW 0 36 76 Left 2
WINDOW 3 36 40 Left 2
SYMATTR InstName R24
SYMATTR Value 1000
SYMBOL res 2432 624 M90
WINDOW 3 32 56 VTop 2
WINDOW 0 0 56 VBottom 2
SYMATTR Value 5000
SYMATTR InstName R25
SYMBOL res 2224 624 M90
WINDOW 3 32 56 VTop 2
WINDOW 0 0 56 VBottom 2
SYMATTR Value 5000
SYMATTR InstName R26
SYMBOL cap 2400 704 M0
WINDOW 3 41 47 Left 2
WINDOW 0 -20 -20 Left 2
SYMATTR Value 72fF
SYMATTR InstName Cmbit13
SYMBOL nmos4 2704 832 M0
WINDOW 0 104 24 Invisible 2
WINDOW 3 179 41 Invisible 2
SYMATTR InstName M31
SYMATTR Value nmos45lp
SYMATTR Value2 l=0.085um w=0.055um
SYMBOL cap 2672 992 M0
WINDOW 3 41 47 Left 2
SYMATTR Value 24fF
SYMATTR InstName Cmbit14
SYMBOL res 2640 816 M180
WINDOW 0 36 76 Left 2
WINDOW 3 36 40 Left 2
SYMATTR InstName R27
SYMATTR Value 1000
SYMBOL res 2768 624 M90
WINDOW 3 32 56 VTop 2
WINDOW 0 0 56 VBottom 2
SYMATTR Value 100
SYMATTR InstName R28
SYMBOL nmos4 5408 832 R0
WINDOW 0 104 24 Invisible 2
WINDOW 3 179 41 Invisible 2
SYMATTR InstName M32
SYMATTR Value nmos45lp
SYMATTR Value2 l=0.085um w=0.055um
SYMBOL cap 5440 992 R0
WINDOW 3 41 47 Left 2
SYMATTR Value 24fF
SYMATTR InstName Cmbit15
SYMBOL res 5472 816 R180
WINDOW 0 36 76 Left 2
WINDOW 3 36 40 Left 2
SYMATTR InstName R29
SYMATTR Value 1000
SYMBOL res 5136 624 R90
WINDOW 3 32 56 VTop 2
WINDOW 0 0 56 VBottom 2
SYMATTR Value 5000
SYMATTR InstName R30
SYMBOL res 5344 624 R90
WINDOW 3 32 56 VTop 2
WINDOW 0 0 56 VBottom 2
SYMATTR Value 5000
SYMATTR InstName R31
SYMBOL cap 5168 704 R0
WINDOW 3 41 47 Left 2
WINDOW 0 -20 -20 Left 2
SYMATTR Value 72fF
SYMATTR InstName Cmbit16
SYMBOL nmos4 4864 832 R0
WINDOW 0 104 24 Invisible 2
WINDOW 3 179 41 Invisible 2
SYMATTR InstName M33
SYMATTR Value nmos45lp
SYMATTR Value2 l=0.085um w=0.055um
SYMBOL cap 4896 992 R0
WINDOW 3 41 47 Left 2
SYMATTR Value 24fF
SYMATTR InstName Cmbit17
SYMBOL res 4928 816 R180
WINDOW 0 36 76 Left 2
WINDOW 3 36 40 Left 2
SYMATTR InstName R32
SYMATTR Value 1000
SYMBOL res 4592 624 R90
WINDOW 3 32 56 VTop 2
WINDOW 0 0 56 VBottom 2
SYMATTR Value 5000
SYMATTR InstName R33
SYMBOL res 4800 624 R90
WINDOW 3 32 56 VTop 2
WINDOW 0 0 56 VBottom 2
SYMATTR Value 5000
SYMATTR InstName R34
SYMBOL cap 4624 704 R0
WINDOW 3 41 47 Left 2
WINDOW 0 -20 -20 Left 2
SYMATTR Value 72fF
SYMATTR InstName Cmbit18
SYMBOL nmos4 4320 832 R0
WINDOW 0 104 24 Invisible 2
WINDOW 3 179 41 Invisible 2
SYMATTR InstName M34
SYMATTR Value nmos45lp
SYMATTR Value2 l=0.085um w=0.055um
SYMBOL cap 4352 992 R0
WINDOW 3 41 47 Left 2
SYMATTR Value 24fF
SYMATTR InstName Cmbit19
SYMBOL res 4384 816 R180
WINDOW 0 36 76 Left 2
WINDOW 3 36 40 Left 2
SYMATTR InstName R35
SYMATTR Value 1000
SYMBOL res 4256 624 R90
WINDOW 3 32 56 VTop 2
WINDOW 0 0 56 VBottom 2
SYMATTR Value 100
SYMATTR InstName R36
SYMBOL pmos4 3216 1424 M0
WINDOW 0 56 32 Invisible 2
WINDOW 3 56 72 Invisible 2
SYMATTR InstName M35
SYMATTR Value pmos45hp
SYMATTR Value2 l=0.16um w={tw}
SYMBOL res 3120 1536 R90
WINDOW 0 0 56 VBottom 2
WINDOW 3 32 56 VTop 2
SYMATTR InstName R37
SYMATTR Value 25000
SYMBOL pmos4 3216 1680 R180
WINDOW 0 56 32 Invisible 2
WINDOW 3 56 72 Invisible 2
SYMATTR InstName M36
SYMATTR Value pmos45hp
SYMATTR Value2 l=0.16um w={tw}
SYMBOL nmos4 3440 1424 R0
WINDOW 0 104 24 Invisible 2
WINDOW 3 179 41 Invisible 2
SYMATTR InstName M37
SYMATTR Value nmos45hp
SYMATTR Value2 l=0.16um w={ntw}
SYMBOL nmos4 3440 1680 M180
WINDOW 0 104 24 Invisible 2
WINDOW 3 179 41 Invisible 2
SYMATTR InstName M38
SYMATTR Value nmos45hp
SYMATTR Value2 l=0.16um w={ntw}
SYMBOL res 3648 1536 R90
WINDOW 0 0 56 VBottom 2
WINDOW 3 32 56 VTop 2
SYMATTR InstName R38
SYMATTR Value 25000
SYMBOL nmos4 3792 1504 M0
WINDOW 0 104 24 Invisible 2
WINDOW 3 179 41 Invisible 2
SYMATTR InstName M39
SYMATTR Value nmos45hp
SYMATTR Value2 l=0.5um w={prentw}
SYMBOL nmos4 3840 1680 M180
WINDOW 0 104 24 Invisible 2
WINDOW 3 179 41 Invisible 2
SYMATTR InstName M40
SYMATTR Value nmos45hp
SYMATTR Value2 l=0.5um w={prentw}
SYMBOL nmos4 3840 1424 R0
WINDOW 0 104 24 Invisible 2
WINDOW 3 179 41 Invisible 2
SYMATTR InstName M41
SYMATTR Value nmos45hp
SYMATTR Value2 l=0.5um w={prentw}
SYMBOL pmos4 4064 1680 R180
WINDOW 0 56 32 Invisible 2
WINDOW 3 56 72 Invisible 2
SYMATTR InstName M42
SYMATTR Value pmos45hp
SYMATTR Value2 l=0.5um w={pretw}
SYMBOL pmos4 4064 1424 M0
WINDOW 0 56 32 Invisible 2
WINDOW 3 56 72 Invisible 2
SYMATTR InstName M43
SYMATTR Value pmos45hp
SYMATTR Value2 l=0.5um w={pretw}
SYMBOL nmos4 3616 1760 R0
WINDOW 0 104 24 Invisible 2
WINDOW 3 179 41 Invisible 2
SYMATTR InstName M44
SYMATTR Value nmos45lp
SYMATTR Value2 l=0.27um w=0.22um
SYMBOL pmos4 2944 1760 R0
WINDOW 0 56 32 Invisible 2
WINDOW 3 56 72 Invisible 2
SYMATTR InstName M45
SYMATTR Value pmos45lp
SYMATTR Value2 l=0.27um w=0.22um
SYMBOL nmos4 1616 1584 M0
WINDOW 0 104 24 Invisible 2
WINDOW 3 179 41 Invisible 2
SYMATTR InstName M46
SYMATTR Value nmos45lp
SYMATTR Value2 l=0.085um w=0.055um
SYMBOL cap 1584 1744 M0
WINDOW 3 41 47 Left 2
SYMATTR Value 24fF
SYMATTR InstName Cmbit20
SYMBOL res 1552 1568 M180
WINDOW 0 36 76 Left 2
WINDOW 3 36 40 Left 2
SYMATTR InstName R39
SYMATTR Value 1000
SYMBOL res 1888 1376 M90
WINDOW 3 32 56 VTop 2
WINDOW 0 0 56 VBottom 2
SYMATTR Value 5000
SYMATTR InstName R40
SYMBOL res 1680 1376 M90
WINDOW 3 32 56 VTop 2
WINDOW 0 0 56 VBottom 2
SYMATTR Value 5000
SYMATTR InstName R41
SYMBOL cap 1856 1456 M0
WINDOW 3 41 47 Left 2
WINDOW 0 -20 -20 Left 2
SYMATTR Value 72fF
SYMATTR InstName Cmbit21
SYMBOL nmos4 2160 1584 M0
WINDOW 0 104 24 Invisible 2
WINDOW 3 179 41 Invisible 2
SYMATTR InstName M47
SYMATTR Value nmos45lp
SYMATTR Value2 l=0.085um w=0.055um
SYMBOL cap 2128 1744 M0
WINDOW 3 41 47 Left 2
SYMATTR Value 24fF
SYMATTR InstName Cmbit22
SYMBOL res 2096 1568 M180
WINDOW 0 36 76 Left 2
WINDOW 3 36 40 Left 2
SYMATTR InstName R42
SYMATTR Value 1000
SYMBOL res 2432 1376 M90
WINDOW 3 32 56 VTop 2
WINDOW 0 0 56 VBottom 2
SYMATTR Value 5000
SYMATTR InstName R43
SYMBOL res 2224 1376 M90
WINDOW 3 32 56 VTop 2
WINDOW 0 0 56 VBottom 2
SYMATTR Value 5000
SYMATTR InstName R44
SYMBOL cap 2400 1456 M0
WINDOW 3 41 47 Left 2
WINDOW 0 -20 -20 Left 2
SYMATTR Value 72fF
SYMATTR InstName Cmbit23
SYMBOL nmos4 2704 1584 M0
WINDOW 0 104 24 Invisible 2
WINDOW 3 179 41 Invisible 2
SYMATTR InstName M48
SYMATTR Value nmos45lp
SYMATTR Value2 l=0.085um w=0.055um
SYMBOL cap 2672 1744 M0
WINDOW 3 41 47 Left 2
SYMATTR Value 24fF
SYMATTR InstName Cmbit24
SYMBOL res 2640 1568 M180
WINDOW 0 36 76 Left 2
WINDOW 3 36 40 Left 2
SYMATTR InstName R45
SYMATTR Value 1000
SYMBOL res 2768 1376 M90
WINDOW 3 32 56 VTop 2
WINDOW 0 0 56 VBottom 2
SYMATTR Value 100
SYMATTR InstName R46
SYMBOL nmos4 5408 1584 R0
WINDOW 0 104 24 Invisible 2
WINDOW 3 179 41 Invisible 2
SYMATTR InstName M49
SYMATTR Value nmos45lp
SYMATTR Value2 l=0.085um w=0.055um
SYMBOL cap 5440 1744 R0
WINDOW 3 41 47 Left 2
SYMATTR Value 24fF
SYMATTR InstName Cmbit25
SYMBOL res 5472 1568 R180
WINDOW 0 36 76 Left 2
WINDOW 3 36 40 Left 2
SYMATTR InstName R47
SYMATTR Value 1000
SYMBOL res 5136 1376 R90
WINDOW 3 32 56 VTop 2
WINDOW 0 0 56 VBottom 2
SYMATTR Value 5000
SYMATTR InstName R48
SYMBOL res 5344 1376 R90
WINDOW 3 32 56 VTop 2
WINDOW 0 0 56 VBottom 2
SYMATTR Value 5000
SYMATTR InstName R49
SYMBOL cap 5168 1456 R0
WINDOW 3 41 47 Left 2
WINDOW 0 -20 -20 Left 2
SYMATTR Value 72fF
SYMATTR InstName Cmbit26
SYMBOL nmos4 4864 1584 R0
WINDOW 0 104 24 Invisible 2
WINDOW 3 179 41 Invisible 2
SYMATTR InstName M50
SYMATTR Value nmos45lp
SYMATTR Value2 l=0.085um w=0.055um
SYMBOL cap 4896 1744 R0
WINDOW 3 41 47 Left 2
SYMATTR Value 24fF
SYMATTR InstName Cmbit27
SYMBOL res 4928 1568 R180
WINDOW 0 36 76 Left 2
WINDOW 3 36 40 Left 2
SYMATTR InstName R50
SYMATTR Value 1000
SYMBOL res 4592 1376 R90
WINDOW 3 32 56 VTop 2
WINDOW 0 0 56 VBottom 2
SYMATTR Value 5000
SYMATTR InstName R51
SYMBOL res 4800 1376 R90
WINDOW 3 32 56 VTop 2
WINDOW 0 0 56 VBottom 2
SYMATTR Value 5000
SYMATTR InstName R52
SYMBOL cap 4624 1456 R0
WINDOW 3 41 47 Left 2
WINDOW 0 -20 -20 Left 2
SYMATTR Value 72fF
SYMATTR InstName Cmbit28
SYMBOL nmos4 4320 1584 R0
WINDOW 0 104 24 Invisible 2
WINDOW 3 179 41 Invisible 2
SYMATTR InstName M51
SYMATTR Value nmos45lp
SYMATTR Value2 l=0.085um w=0.055um
SYMBOL cap 4352 1744 R0
WINDOW 3 41 47 Left 2
SYMATTR Value 24fF
SYMATTR InstName Cmbit29
SYMBOL res 4384 1568 R180
WINDOW 0 36 76 Left 2
WINDOW 3 36 40 Left 2
SYMATTR InstName R53
SYMATTR Value 1000
SYMBOL res 4256 1376 R90
WINDOW 3 32 56 VTop 2
WINDOW 0 0 56 VBottom 2
SYMATTR Value 100
SYMATTR InstName R54
TEXT -240 520 Left 2 !.include cmosedu_models.txt
TEXT -72 488 Left 2 !.ic v(bitline0)={vddhalf} v(bitline1)={vddhalf} v(mb0)={vdd} v(mb11)={vdd} v(mb22)={vdd}
TEXT -240 488 Left 2 !.tran 230ns uic
TEXT -240 776 Left 2 ;.param vdd=1.2V
TEXT -240 824 Left 2 ;.param vddhalf = 0.6V
TEXT -64 408 Left 4 ;Simulation Configuations
TEXT -232 664 Left 3 ;Looping through different Vdd values
TEXT -584 696 Left 2 ;// Select a few volts only
TEXT -488 1056 Left 2 ;.param tw= 1um
TEXT -480 952 Left 2 ;.param vdd=1.2V
TEXT -480 1000 Left 2 ;.param vddhalf=0.6V
TEXT -464 1104 Left 2 ;.param ntw=1um
TEXT -232 872 Left 2 !.param tw=2um
TEXT 0 864 Left 2 !.param ntw = 1um
TEXT 232 944 Left 2 !.param pretw=2um
TEXT 232 992 Left 2 !.param prentw=1um
TEXT -280 1240 Left 2 !.param vdd=1.2V
TEXT -280 1288 Left 2 !.param vddhalf=0.6V

The netlist it stands for:
* diva-dram_bitline.asc
VDD VDD 0 {vdd}
VDDby2 VDDby2 0 {vddhalf}
Vsp sense_P 0 PWL(15n {vdd} 15.5n 0 40n 0 40.5n {vdd}) Rser=100 Cpar=10fF
Vra0 ra0 0 PWL(10n 0 10.5n 3 35n 3.0 37.5n 0) Rser=2048 Cpar=0.6pF
Vsn sense_N 0 PWL(15n 0 15.5n {vdd} 40n {vdd} 40.5n 0) Rser=100 Cpar=10fF
Veq1 EqNot 0 PWL(0n 0 10.0n 0 10.5n {vdd} 40n {vdd} 40.5n 0)
Veq2 Eq 0 PWL(0n 1.5 10.0n 1.5 10.5n 0 40n 0 40.5n {vdd})
M15 bitline1 bitline0 N010 VDD pmos45hp l=0.16um w={tw}
R9 N010 ACT 25000
M16 bitline0 bitline1 N010 VDD pmos45hp l=0.16um w={tw}
M17 bitline1 bitline0 N011 0 nmos45hp l=0.16um w={ntw}
M18 bitline0 bitline1 N011 0 nmos45hp l=0.16um w={ntw}
R10 N012 N011 25000
M19 bitline1 Eq bitline0 0 nmos45hp l=0.5um w={prentw}
M20 bitline0 Eq VDDby2 0 nmos45hp l=0.5um w={prentw}
M21 bitline1 Eq VDDby2 0 nmos45hp l=0.5um w={prentw}
M22 bitline0 EqNot VDDby2 VDD pmos45hp l=0.5um w={pretw}
M23 bitline1 EqNot VDDby2 VDD pmos45hp l=0.5um w={pretw}
M24 N012 sense_N 0 0 nmos45lp l=0.27um w=0.22um
M25 ACT sense_P VDD VDD pmos45lp l=0.27um w=0.22um
M1 N013 ra0 mb0 0 nmos45lp l=0.085um w=0.055um
Cmbit0 mb0 0 24fF
R1 N013 BL0 1000
R2 N001 N002 5000
R3 BL0 N001 5000
Cmbit4 N001 0 72fF
M2 N014 ra1 mb1 0 nmos45lp l=0.085um w=0.055um
Cmbit1 mb1 0 24fF
R4 N014 N002 1000
R6 N003 N004 5000
R7 N002 N003 5000
Cmbit3 N003 0 72fF
M3 N015 ra2 mb2 0 nmos45lp l=0.085um w=0.055um
Cmbit5 mb2 0 24fF
R8 N015 N004 1000
R13 N004 bitline1 100
M4 N018 ra5 mb5 0 nmos45lp l=0.085um w=0.055um
Cmbit2 mb5 0 24fF
R5 N018 N009 1000
R11 N008 N007 5000
R12 N009 N008 5000
Cmbit6 N008 0 72fF
M5 N017 ra4 mb4 0 nmos45lp l=0.085um w=0.055um
Cmbit7 mb4 0 24fF
R14 N017 N007 1000
R15 N006 N005 5000
R16 N007 N006 5000
Cmbit8 N006 0 72fF
M6 N016 ra3 mb3 0 nmos45lp l=0.085um w=0.055um
Cmbit9 mb3 0 24fF
R17 N016 N005 1000
R18 N005 bitline0 100
M7 bitline11 bitline10 N028 VDD pmos45hp l=0.16um w={tw}
R19 N028 ACT 25000
M8 bitline10 bitline11 N028 VDD pmos45hp l=0.16um w={tw}
M9 bitline11 bitline10 N029 0 nmos45hp l=0.16um w={ntw}
M10 bitline10 bitline11 N029 0 nmos45hp l=0.16um w={ntw}
R20 N030 N029 25000
M11 bitline11 Eq bitline10 0 nmos45hp l=0.5um w={prentw}
M12 bitline10 Eq VDDby2 0 nmos45hp l=0.5um w={prentw}
M13 bitline11 Eq VDDby2 0 nmos45hp l=0.5um w={prentw}
M14 bitline10 EqNot VDDby2 VDD pmos45hp l=0.5um w={pretw}
M26 bitline11 EqNot VDDby2 VDD pmos45hp l=0.5um w={pretw}
M27 N030 sense_N 0 0 nmos45lp l=0.27um w=0.22um
M28 ACT sense_P VDD VDD pmos45lp l=0.27um w=0.22um
M29 N031 ra1 mb10 0 nmos45lp l=0.085um w=0.055um
Cmbit10 mb10 0 24fF
R21 N031 N019 1000
R22 N020 BL11 5000
R23 N019 N020 5000
Cmbit11 N020 0 72fF
M30 N032 ra0 mb11 0 nmos45lp l=0.085um w=0.055um
Cmbit12 mb11 0 24fF
R24 N032 BL11 1000
R25 N021 N022 5000
R26 BL11 N021 5000
Cmbit13 N021 0 72fF
M31 N033 ra2 mb12 0 nmos45lp l=0.085um w=0.055um
Cmbit14 mb12 0 24fF
R27 N033 N022 1000
R28 N022 bitline11 100
M32 N036 ra5 mb15 0 nmos45lp l=0.085um w=0.055um
Cmbit15 mb15 0 24fF
R29 N036 N027 1000
R30 N026 N025 5000
R31 N027 N026 5000
Cmbit16 N026 0 72fF
M33 N035 ra4 mb14 0 nmos45lp l=0.085um w=0.055um
Cmbit17 mb14 0 24fF
R32 N035 N025 1000
R33 N024 N023 5000
R34 N025 N024 5000
Cmbit18 N024 0 72fF
M34 N034 ra3 mb13 0 nmos45lp l=0.085um w=0.055um
Cmbit19 mb13 0 24fF
R35 N034 N023 1000
R36 N023 bitline10 100
M35 bitline21 bitline20 N046 VDD pmos45hp l=0.16um w={tw}
R37 N046 ACT 25000
M36 bitline20 bitline21 N046 VDD pmos45hp l=0.16um w={tw}
M37 bitline21 bitline20 N047 0 nmos45hp l=0.16um w={ntw}
M38 bitline20 bitline21 N047 0 nmos45hp l=0.16um w={ntw}
R38 N048 N047 25000
M39 bitline21 Eq bitline20 0 nmos45hp l=0.5um w={prentw}
M40 bitline20 Eq VDDby2 0 nmos45hp l=0.5um w={prentw}
M41 bitline21 Eq VDDby2 0 nmos45hp l=0.5um w={prentw}
M42 bitline20 EqNot VDDby2 VDD pmos45hp l=0.5um w={pretw}
M43 bitline21 EqNot VDDby2 VDD pmos45hp l=0.5um w={pretw}
M44 N048 sense_N 0 0 nmos45lp l=0.27um w=0.22um
M45 ACT sense_P VDD VDD pmos45lp l=0.27um w=0.22um
M46 N049 ra1 mb20 0 nmos45lp l=0.085um w=0.055um
Cmbit20 mb20 0 24fF
R39 N049 N037 1000
R40 N038 N039 5000
R41 N037 N038 5000
Cmbit21 N038 0 72fF
M47 N050 ra2 mb21 0 nmos45lp l=0.085um w=0.055um
Cmbit22 mb21 0 24fF
R42 N050 N039 1000
R43 N040 BL22 5000
R44 N039 N040 5000
Cmbit23 N040 0 72fF
M48 N051 ra0 mb22 0 nmos45lp l=0.085um w=0.055um
Cmbit24 mb22 0 24fF
R45 N051 BL22 1000
R46 BL22 bitline21 100
M49 N054 ra5 mb25 0 nmos45lp l=0.085um w=0.055um
Cmbit25 mb25 0 24fF
R47 N054 N045 1000
R48 N044 N043 5000
R49 N045 N044 5000
Cmbit26 N044 0 72fF
M50 N053 ra4 mb24 0 nmos45lp l=0.085um w=0.055um
Cmbit27 mb24 0 24fF
R50 N053 N043 1000
R51 N042 N041 5000
R52 N043 N042 5000
Cmbit28 N042 0 72fF
M51 N052 ra3 mb23 0 nmos45lp l=0.085um w=0.055um
Cmbit29 mb23 0 24fF
R53 N052 N041 1000
R54 N041 bitline20 100
.model NMOS NMOS
.model PMOS PMOS
.lib standard.mos
.include cmosedu_models.txt
.ic v(bitline0)={vddhalf} v(bitline1)={vddhalf} v(mb0)={vdd} v(mb11)={vdd} v(mb22)={vdd}
.tran 230ns uic
* .param vdd=1.2V
* .param vddhalf = 0.6V
* Simulation Configuations
* Looping through different Vdd values
* // Select a few volts only
* .param tw= 1um
* .param vdd=1.2V
* .param vddhalf=0.6V
* .param ntw=1um
.param tw=2um
.param ntw = 1um
.param pretw=2um
.param prentw=1um
.param vdd=1.2V
.param vddhalf=0.6V
.backanno
.end